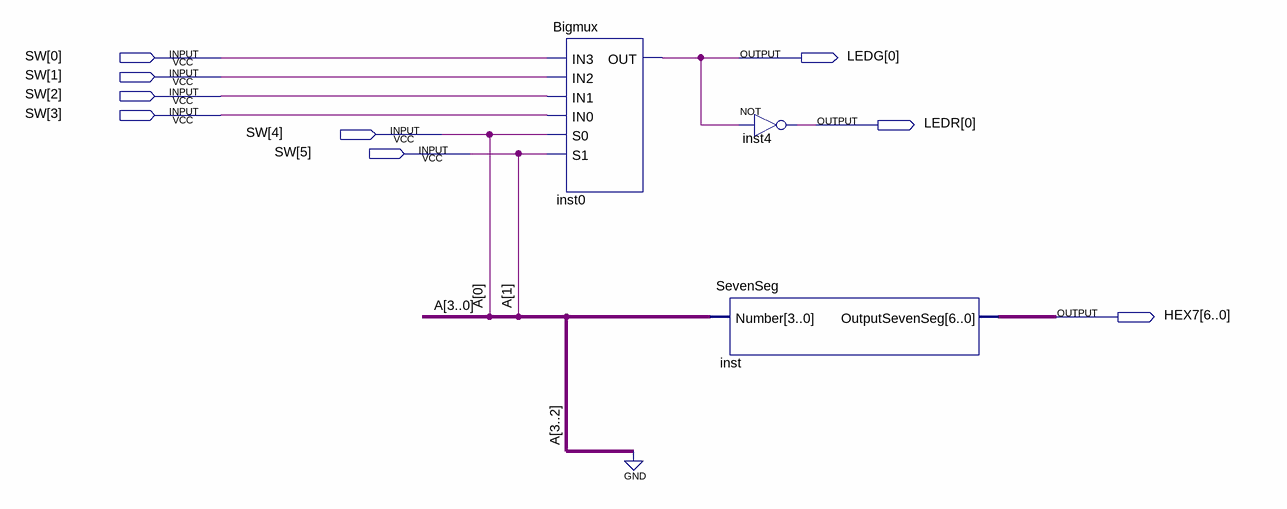
[diagram p0: schematic sheet]
// Quartus schematic parta.bdf as structural Verilog: 3 symbols, 9 pins
module parta (
  input  [5:0] SW,
  output [0:0] LEDG,
  output [0:0] LEDR,
  output [6:0] HEX7
);

  Bigmux inst0 (.IN3(SW[0]), .IN2(SW[1]), .IN1(SW[2]), .IN0(SW[3]), .S0(SW[4]), .S1(SW[5]), .OUT(LEDG[0]));
  SevenSeg inst (.Number({2'b00, SW[5:4]}), .OutputSevenSeg(HEX7));
  not inst4 (LEDR[0], LEDG[0]);

  // Other names for the same wires on the sheet: A[1:0] = SW[5:4]
endmodule
